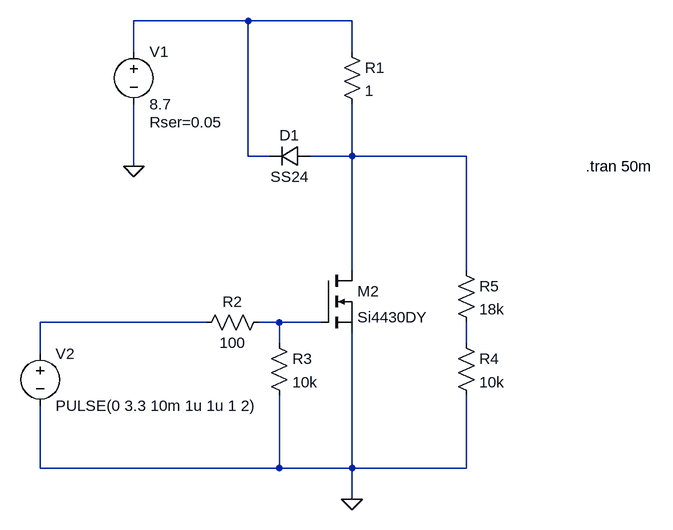
[diagram p0: schematic Pyro Channel Sim.asc]
Pyro Channel Sim.asc, the LTspice schematic file:
Version 4.1
SHEET 1 880 680
WIRE 64 -368 -112 -368
WIRE 224 -368 64 -368
WIRE -112 -320 -112 -368
WIRE 224 -320 224 -368
WIRE 64 -160 64 -368
WIRE 96 -160 64 -160
WIRE 224 -160 224 -240
WIRE 224 -160 160 -160
WIRE 400 -160 224 -160
WIRE -112 -144 -112 -240
WIRE 224 16 224 -160
WIRE 400 16 400 -160
WIRE 0 96 -256 96
WIRE 112 96 80 96
WIRE 176 96 112 96
WIRE 112 128 112 96
WIRE 400 128 400 96
WIRE -256 144 -256 96
WIRE -256 320 -256 224
WIRE 112 320 112 208
WIRE 112 320 -256 320
WIRE 224 320 224 112
WIRE 224 320 112 320
WIRE 400 320 400 208
WIRE 400 320 224 320
WIRE 224 368 224 320
FLAG 224 368 0
FLAG -112 -144 0
SYMBOL voltage -112 -336 R0
WINDOW 123 0 0 Left 0
WINDOW 39 24 124 Left 2
SYMATTR SpiceLine Rser=0.05
SYMATTR InstName V1
SYMATTR Value 8.7
SYMBOL res 208 -336 R0
SYMATTR InstName R1
SYMATTR Value 1
SYMBOL voltage -256 128 R0
WINDOW 123 0 0 Left 0
WINDOW 39 0 0 Left 0
SYMATTR InstName V2
SYMATTR Value PULSE(0 3.3 10m 1u 1u 1 2)
SYMBOL res -16 112 R270
WINDOW 0 32 56 VTop 2
WINDOW 3 0 56 VBottom 2
SYMATTR InstName R2
SYMATTR Value 100
SYMBOL res 96 112 R0
SYMATTR InstName R3
SYMATTR Value 10k
SYMBOL res 384 112 R0
SYMATTR InstName R4
SYMATTR Value 10k
SYMBOL res 384 0 R0
SYMATTR InstName R5
SYMATTR Value 18k
SYMBOL diode 160 -176 R90
WINDOW 0 0 32 VBottom 2
WINDOW 3 32 32 VTop 2
SYMATTR InstName D1
SYMATTR Value SS24
SYMBOL nmos 176 16 R0
SYMATTR InstName M2
SYMATTR Value Si4430DY
TEXT 584 -144 Left 2 !.tran 50m

The netlist it stands for:
* Pyro Channel Sim.asc
V1 N001 0 8.7 Rser=0.05
R1 N001 N002 1
V2 N003 0 PULSE(0 3.3 10m 1u 1u 1 2)
R2 N003 N004 100
R3 N004 0 10k
R4 N005 0 10k
R5 N002 N005 18k
D1 N002 N001 SS24
M2 N002 N004 0 0 Si4430DY
.model D D
.lib standard.dio
.model NMOS NMOS
.model PMOS PMOS
.lib standard.mos
.tran 50m
.backanno
.end